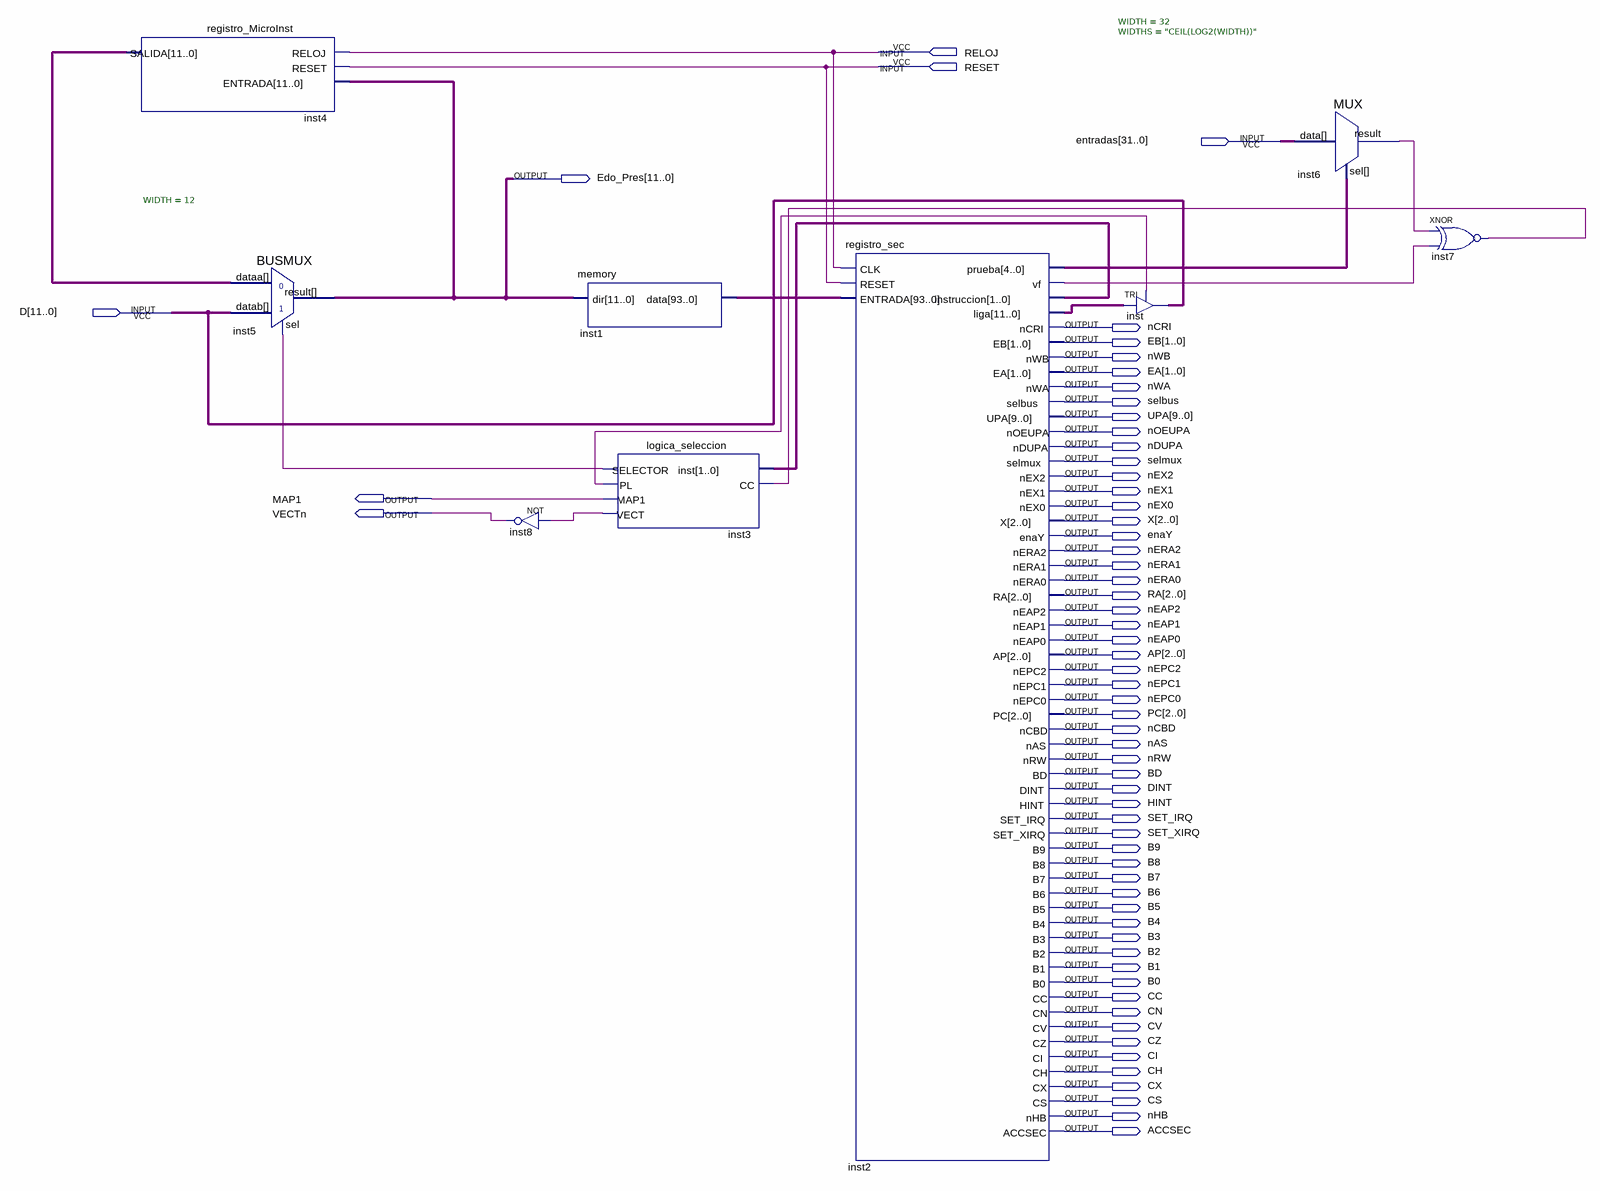
[diagram p0: schematic sheet]
// Quartus schematic secuenciador.bdf as structural Verilog: 9 symbols, 62 pins
module secuenciador (
  input  RELOJ,
  input  RESET,
  input  [31:0] entradas,
  input  [11:0] D,
  output [11:0] Edo_Pres,
  output nCRI,
  output [1:0] EB,
  output nWB,
  output [1:0] EA,
  output nWA,
  output selbus,
  output [9:0] UPA,
  output nOEUPA,
  output nDUPA,
  output selmux,
  output nEX2,
  output nEX1,
  output MAP1,
  output nEX0,
  output VECTn,
  output [2:0] X,
  output enaY,
  output nERA2,
  output nERA1,
  output nERA0,
  output [2:0] RA,
  output nEAP2,
  output nEAP1,
  output nEAP0,
  output [2:0] AP,
  output nEPC2,
  output nEPC1,
  output nEPC0,
  output [2:0] PC,
  output nCBD,
  output nAS,
  output nRW,
  output BD,
  output DINT,
  output HINT,
  output SET_IRQ,
  output SET_XIRQ,
  output B9,
  output B8,
  output B7,
  output B6,
  output B5,
  output B4,
  output B3,
  output B2,
  output B1,
  output B0,
  output CC,
  output CN,
  output CV,
  output CZ,
  output CI,
  output CH,
  output CX,
  output CS,
  output nHB,
  output ACCSEC
);

  wire inst2_vf, inst3_pl, inst3_selector, inst3_vect, inst6_result, inst7_out;
  wire [1:0] inst2_instruccion;
  wire [4:0] inst2_prueba;
  wire [11:0] inst2_liga, inst4_salida;
  wire [93:0] inst1_data;

  registro_MicroInst inst4 (.RELOJ(RELOJ), .RESET(RESET), .ENTRADA(Edo_Pres), .SALIDA(inst4_salida));
  BUSMUX #(.WIDTH(12)) inst5 (.datab(D), .sel(inst3_selector), .dataa(inst4_salida), .result(Edo_Pres));
  not inst8 (VECTn, inst3_vect);
  memory inst1 (.dir(Edo_Pres), .data(inst1_data));
  logica_seleccion inst3 (
    .inst(inst2_instruccion), .CC(inst7_out), .SELECTOR(inst3_selector), .PL(inst3_pl), .MAP1(MAP1),
    .VECT(inst3_vect));
  registro_sec inst2 (
    .CLK(RELOJ), .RESET(RESET), .ENTRADA(inst1_data), .prueba(inst2_prueba), .vf(inst2_vf),
    .instruccion(inst2_instruccion), .liga(inst2_liga), .nCRI(nCRI), .EB(EB), .nWB(nWB), .EA(EA), .nWA(nWA),
    .selbus(selbus), .UPA(UPA), .nOEUPA(nOEUPA), .nDUPA(nDUPA), .selmux(selmux), .nEX2(nEX2), .nEX1(nEX1),
    .nEX0(nEX0), .X(X), .enaY(enaY), .nERA2(nERA2), .nERA1(nERA1), .nERA0(nERA0), .RA(RA), .nEAP2(nEAP2),
    .nEAP1(nEAP1), .nEAP0(nEAP0), .AP(AP), .nEPC2(nEPC2), .nEPC1(nEPC1), .nEPC0(nEPC0), .PC(PC), .nCBD(nCBD),
    .nAS(nAS), .nRW(nRW), .BD(BD), .DINT(DINT), .HINT(HINT), .SET_IRQ(SET_IRQ), .SET_XIRQ(SET_XIRQ), .B9(B9),
    .B8(B8), .B7(B7), .B6(B6), .B5(B5), .B4(B4), .B3(B3), .B2(B2), .B1(B1), .B0(B0), .CC(CC), .CN(CN),
    .CV(CV), .CZ(CZ), .CI(CI), .CH(CH), .CX(CX), .CS(CS), .nHB(nHB), .ACCSEC(ACCSEC));
  TRI inst[11:0] (.IN(inst2_liga), .OE(inst3_pl), .OUT(D));
  MUX #(.WIDTH(32), .WIDTHS("CEIL(LOG2(WIDTH))")) inst6 (.data(entradas), .sel(inst2_prueba), .result(inst6_result));
  xnor inst7 (inst7_out, inst6_result, inst2_vf);
endmodule
